# EAGLE design LifiEmitter (EAGLE 8.6.0)
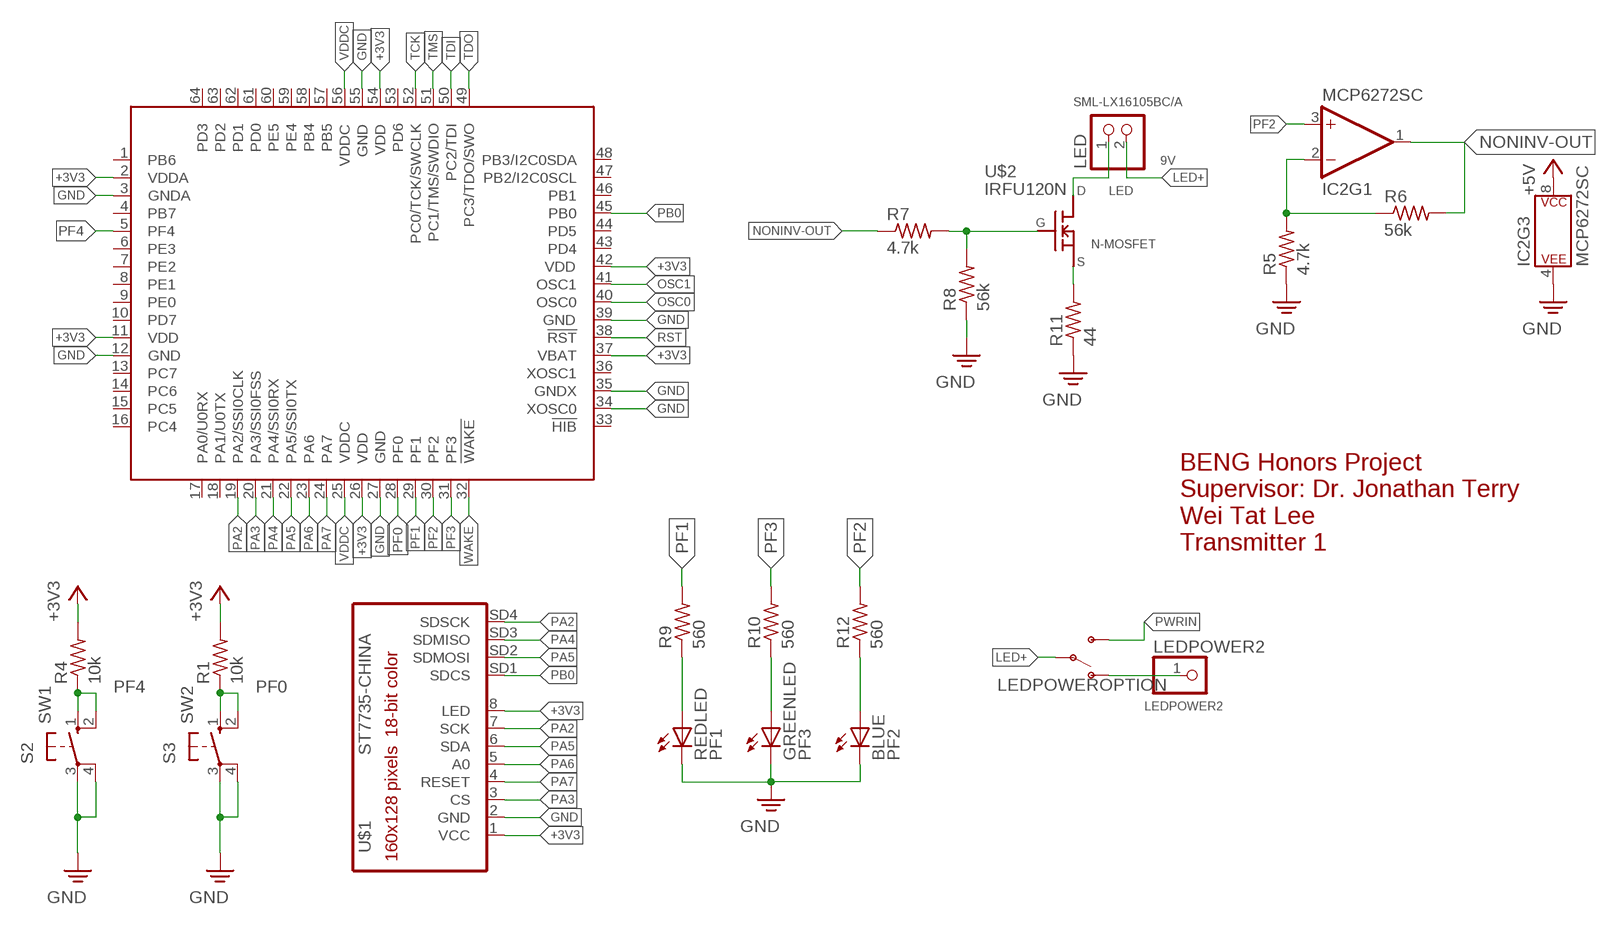
[diagram p0: schematic, sheet 1, part 1 of 2]
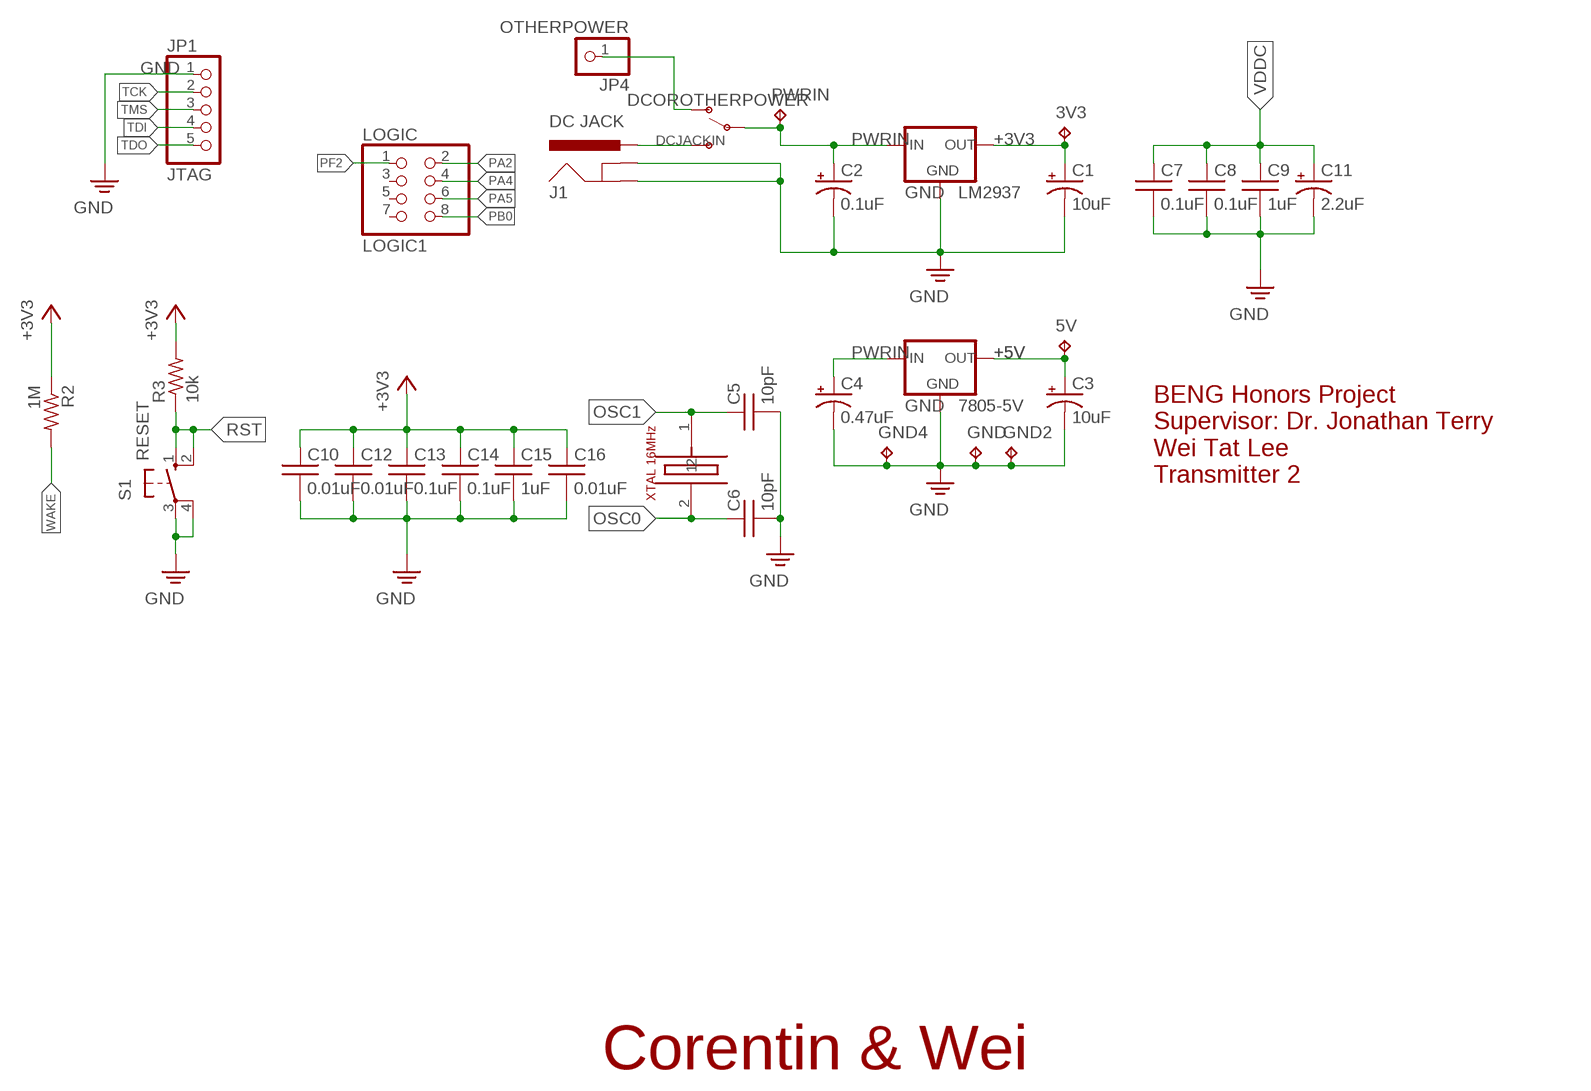
[diagram p1: schematic, sheet 1, part 2 of 2]

## Parts
3V3  TP_KEYSTONE500X  [P1.1MM]
5V  TP_KEYSTONE500X  [P1.1MM]
7805-5V  78XXS  [78XXS]
BLUE  PF2  LED5MM  [LED5MM]
C1  10uF  CAPACITOR_POLARIZEDE5-6  [CAP200MILPOLARIZED]
C2  0.1uF  CAPACITOR_POLARIZEDE5-6  [CAP200MILPOLARIZED]
C3  10uF  CAPACITOR_POLARIZEDE5-6  [CAP200MILPOLARIZED]
C4  0.47uF  CAPACITOR_POLARIZEDE5-6  [CAP200MILPOLARIZED]
C5  10pF  CAPACITOR025-024X044  [CAP100MIL]
C6  10pF  CAPACITOR025-024X044  [CAP100MIL]
C7  0.1uF  CAPACITOR025-024X044  [CAP100MIL]
C8  0.1uF  CAPACITOR025-024X044  [CAP100MIL]
C9  1uF  CAPACITOR025-024X044  [CAP100MIL]
C10  0.01uF  CAPACITOR025-024X044  [CAP100MIL]
C11  2.2uF  CAPACITOR_POLARIZEDE5-6  [CAP200MILPOLARIZED]
C12  0.01uF  CAPACITOR025-024X044  [CAP100MIL]
C13  0.1uF  CAPACITOR025-024X044  [CAP100MIL]
C14  0.1uF  CAPACITOR025-024X044  [CAP100MIL]
C15  1uF  CAPACITOR025-024X044  [CAP100MIL]
C16  0.01uF  CAPACITOR025-024X044  [CAP100MIL]
DCOROTHERPOWER  SWITCH-SPDT-PTH-11.6X4.0MM  [SWITCH_SPDT_PTH_11.6X4.0MM]
GND  TP_KEYSTONE500X  [P1.1MM]
GND2  TP_KEYSTONE500X  [P1.1MM]
GND4  TP_KEYSTONE500X  [P1.1MM]
GREENLED  PF3  LED5MM  [LED5MM]
IC1  TM4C123[1,3,B]XXPM  [PM_S-PQFP-G64]
IC2  MCP6272SC  [SOCKET-08]
J1  DC JACK  POWER_JACKPTH_BREAD  [POWER_JACK_PTH_BREAD]
JP1  JTAG  PINHD-1X5  [1X05]
JP4  OTHERPOWER  PINHD-1X1  [1X01]
LED  PINHD-1X2  [1X02]
LEDPOWER2  PINHD-1X1  [1X01]
LEDPOWEROPTION  SWITCH-SPDT-PTH-11.6X4.0MM  [SWITCH_SPDT_PTH_11.6X4.0MM]
LM2937  78XXS  [78XXS]
LOGIC  LOGIC1  PINHD-2X4  [2X04]
PWRIN  TP_KEYSTONE500X  [P1.1MM]
R1  10k  RESISTOR0309/10  [RES400MIL]
R2  1M  RESISTOR0309/10  [RES400MIL]
R3  10k  RESISTOR0309/10  [RES400MIL]
R4  10k  RESISTOR0309/10  [RES400MIL]
R5  4.7k  RESISTOR0309/10  [RES400MIL]
R6  56k  RESISTOR0309/10  [RES400MIL]
R7  4.7k  RESISTOR0309/10  [RES400MIL]
R8  56k  RESISTOR0309/10  [RES400MIL]
R9  560  RESISTOR0309/10  [RES400MIL]
R10  560  RESISTOR0309/10  [RES400MIL]
R11  44  RESISTOR0309/10  [RES400MIL]
R12  560  RESISTOR0309/10  [RES400MIL]
REDLED  PF1  LED5MM  [LED5MM]
S1  RESET  B3F-1052  [B3F-10XX]
S2  SW1  B3F-1052  [B3F-10XX]
S3  SW2  B3F-1052  [B3F-10XX]
U$1  ST7735-CHINA  [ST7735-CHINA]
U$2  IRFU120N  [TO251AA-V]
XTAL  16MHz  XTAL  [XTAL]

## Nets
+3V3: 3V3.TP C1.+ C10.1 C12.1 C13.1 C14.1 C15.1 C16.1 IC1.2(VDDA) IC1.11(VDD) IC1.26(VDD) IC1.37(VBAT) IC1.42(VDD) IC1.54(VDD) LM2937.OUT R1.2 R2.1 R3.2 R4.2 U$1.1(VCC) U$1.8(LED)
+5V: 5V.TP 7805-5V.OUT C3.+ IC2.8(P$V+)
DCJACKIN: DCOROTHERPOWER.3(S) J1.PWR
GND: 7805-5V.GND BLUE.K(C) C1.- C2.- C3.- C4.- C5.2 C6.2 C7.2 C8.2 C9.2 C10.2 C11.- C12.2 C13.2 C14.2 C15.2 C16.2 GND2.TP GND4.TP GND.TP GREENLED.K(C) IC1.3(GNDA) IC1.12(GND) IC1.27(GND) IC1.34(XOSC0) IC1.35(GNDX) IC1.39(GND) IC1.55(GND) IC2.4(P$V-) J1.GND J1.GNDBREAK JP1.1 LM2937.GND R5.1 R8.1 R11.1 REDLED.K(C) S1.3(P) S1.4(P1) S2.3(P) S2.4(P1) S3.3(P) S3.4(P1) U$1.2(GND)
LED+: LED.2 LEDPOWEROPTION.2(P)
LED-: LED.1 U$2.2(D)
LEDPOWER2: LEDPOWER2.1 LEDPOWEROPTION.1(O)
N$4: R9.1 REDLED.A
N$5: GREENLED.A R10.1
N$6: BLUE.A R12.1
NFET-G: R7.2 R8.2 U$2.1(G)
NFET-S: R11.2 U$2.3(S)
NONINV-OUT: IC2.1(OUT) R6.2 R7.1
NONINVIN-: IC2.2(-IN) R5.2 R6.1
OSC0: C6.1 IC1.40(OSC0) XTAL.2
OSC1: C5.1 IC1.41(OSC1) XTAL.1
OTHERPOWER: DCOROTHERPOWER.1(O) JP4.1
PA2: IC1.19(PA2/SSI0CLK) LOGIC.2 U$1.7(SCK) U$1.SD4(SDSCK)
PA3: IC1.20(PA3/SSI0FSS) U$1.3(CS)
PA4: IC1.21(PA4/SSI0RX) LOGIC.4 U$1.SD3(SDMISO)
PA5: IC1.22(PA5/SSI0TX) LOGIC.6 U$1.6(SDA) U$1.SD2(SDMOSI)
PA6: IC1.23(PA6) U$1.5(A0)
PA7: IC1.24(PA7) U$1.4(RESET)
PB0: IC1.45(PB0) LOGIC.8 U$1.SD1(SDCS)
PF0: IC1.28(PF0) R1.1 S3.1(S) S3.2(S1)
PF1: IC1.29(PF1) R9.2
PF2: IC1.30(PF2) IC2.3(+IN) LOGIC.1 R12.2
PF3: IC1.31(PF3) R10.2
PF4: IC1.5(PF4) R4.1 S2.1(S) S2.2(S1)
PWRIN: 7805-5V.IN C2.+ C4.+ DCOROTHERPOWER.2(P) LEDPOWEROPTION.3(S) LM2937.IN PWRIN.TP
RST: IC1.38(!RST) R3.1 S1.1(S) S1.2(S1)
TCK: IC1.52(PC0/TCK/SWCLK) JP1.2
TDI: IC1.50(PC2/TDI) JP1.4
TDO: IC1.49(PC3/TDO/SWO) JP1.5
TMS: IC1.51(PC1/TMS/SWDIO) JP1.3
VDDC: C7.1 C8.1 C9.1 C11.+ IC1.25(VDDC) IC1.56(VDDC)
WAKE: IC1.32(!WAKE) R2.2
Unconnected: IC1.1(PB6) IC1.4(PB7) IC1.6(PE3) IC1.7(PE2) IC1.8(PE1) IC1.9(PE0) IC1.10(PD7) IC1.13(PC7) IC1.14(PC6) IC1.15(PC5) IC1.16(PC4) IC1.17(PA0/U0RX) IC1.18(PA1/U0TX) IC1.33(!HIB) IC1.36(XOSC1) IC1.43(PD4) IC1.44(PD5) IC1.46(PB1) IC1.47(PB2/I2C0SCL) IC1.48(PB3/I2C0SDA) IC1.53(PD6) IC1.57(PB5) IC1.58(PB4) IC1.59(PE4) IC1.60(PE5) IC1.61(PD0) IC1.62(PD1) IC1.63(PD2) IC1.64(PD3) IC2.5(+IN) IC2.6(-IN) IC2.7(OUT) LOGIC.3 LOGIC.5 LOGIC.7

## Notes on the sheet
- SML-LX16105BC/A
- 9V
- D | LED
- G
- N-MOSFET
- S
- BENG Honors Project
  Supervisor: Dr. Jonathan Terry
  Wei Tat Lee
  Transmitter 2
- BENG Honors Project
  Supervisor: Dr. Jonathan Terry
  Wei Tat Lee
  Transmitter 1
- LEDPOWER2
- Corentin & Wei

## Library data of the parts
3V3 5V GND GND2 GND4 PWRIN = EE445L:TP: Test pad Test point, black, Keystone Electronics 5001, Digikey 5001K-ND Test point, orange, Keystone Electronics 5003, Digikey 5003K-ND Test point, yellow, Keystone Electronics 5004, Digikey 5004K-ND Test point, white, Keystone Electronics 5002, Digikey 5002K-ND Test point, red, Keystone Electronics 5000, Digikey 5000K-ND
7805-5V LM2937 = EE445L:78XXS: VOLTAGE REGULATOR 7805, 78M05, LM2937-5.0, LM2937-3.3
BLUE GREENLED REDLED = EE445L:LED: Avago Technologies LED Green 2mA 5mm diffused, HLMP-4740, Digikey 516-1327-ND Red 1.6V 1mA 5mm diffused, HLMP-D150, Digikey 516-1323-ND Yellow 2mA 5mm diffused, HLMP-4719, Digikey 516-1326-ND Orange 10mA 5mm diffused HLMP-D401, Digikey 516-1330-ND Blue 10mA 5mm diffused
C1-C4 C11 = EE445L:CAPACITOR_POLARIZED: POLARIZED CAPACITOR, American symbol
C5-C10 C12-C16 = EE445L:CAPACITOR: CAPACITOR, American symbol
DCOROTHERPOWER LEDPOWEROPTION = SparkFun-Switches:SWITCH-SPDT: Single Pole, Double Throw (SPDT) Switch Single-pole, double-throw (SPDT) switch. Variant Overview SMD-AYZ0202 Surface Mount DPDT Switch <https://www.sparkfun.com/products/597> (COM-00597) Used on e.g. LilyPad Arduino USB - ATmega32U4 Board <https://www.sparkfun.com/products/12049> PTH-11.6X4.0MM SPDT Mini Power Switch <https://www.sparkfun.com/products/102> (COM-00102) Used on e.g. SparkFun Simon Says - Through-Hole Soldering Kit <https://www.sparkfun.com/products/10547> (KIT-10547) PTH-11.6X4.0MM-KIT KIT version of SPDT Mini Power Switch - Simplifies soldering by removing tStop of switch pins - only one side can be soldered. PTH-11.6X4.0MM-LOCK LOCK version of SPDT Mini Power Switch - Offset pins hold switch in place for easier soldering. SMD-RIGHT-ANGLE Surface Mount Right Angle Switch <https://www.sparkfun.com/products/10860> (COM-10860) Used on e.g. SparkFun ESP8266 Thing <https://www.sparkfun.com/products/13231>; PROD_ID: SWCH-08261; SF_SKU: COM-00102
IC1 = ti-tiva:TM4C123[1,3,B]XX: by RobG (430things/43oh/Tindie)
IC2 = my-library:MCP6272: Generic op-amp footprint This component is for the standard 358 pinning of a dual op-amp From the LM358 datasheet: Pin 1: Output A Pin 2: Inverting Input A Pin 3: Non-Inverting Input A Pin 4: Gnd Pin 5: Non-Inverting Input B Pin 6: Inverting Input B Pin 7: Output B Pin 8: V+
J1 = SparkFun-Connectors:POWER_JACK: Power Jack Connector This is the standard 5.5mm barrel jack for power. The PTH is the most common, proven, reliable, footprint. The Slot footprint only works if the mill layer is transmitted to the PCB fab house so be warned. Here are the connectors we sell at SparkFun: DC Barrel Power Jack/Connector <https://www.sparkfun.com/products/119> (PRT-00119) DC Barrel Power Jack/Connector (SMD) <https://www.sparkfun.com/products/12748> (PRT-12748) DC Barrel Jack Adapter - Breadboard Compatible <https://www.sparkfun.com/products/10811> (PRT-10811) It is used on this SparkFun product (and many, many others): SparkFun RedBoard - Programmed with Arduino <https://www.sparkfun.com/products/12757> (DEV-12757) Also, if you need a mating power supply or connector, please check these out: Wall Adapter Power Supply - 9VDC 650mA <https://www.sparkfun.com/products/298> (TOL-00298) DC Barrel Jack Adapter - Male <https://www.sparkfun.com/products/10287> (PRT-10287); PROD_ID: PRT-10811
JP1 = pinhead:PINHD-1X5: PIN HEADER
JP4 LEDPOWER2 = EE445L:PINHD-1X1: PIN HEADER
LED = EE445L:PINHD-1X2: PIN HEADER
LOGIC = EE445L:PINHD-2X4: PIN HEADER
R1-R12 = EE445L:RESISTOR: RESISTOR, American symbol
S1-S3 = EE445L:B3F-1052: OMRON SWITCH 1.1mm holes; MPN: B3F-1000; OC_FARNELL: 176432; OC_NEWARK: 36M3542
U$1 = my-library:ST7735-CHINA
U$2 = my-library:IRFU120N
XTAL = LEE:XTAL: NX5032GAcrystal XTAL

## Board
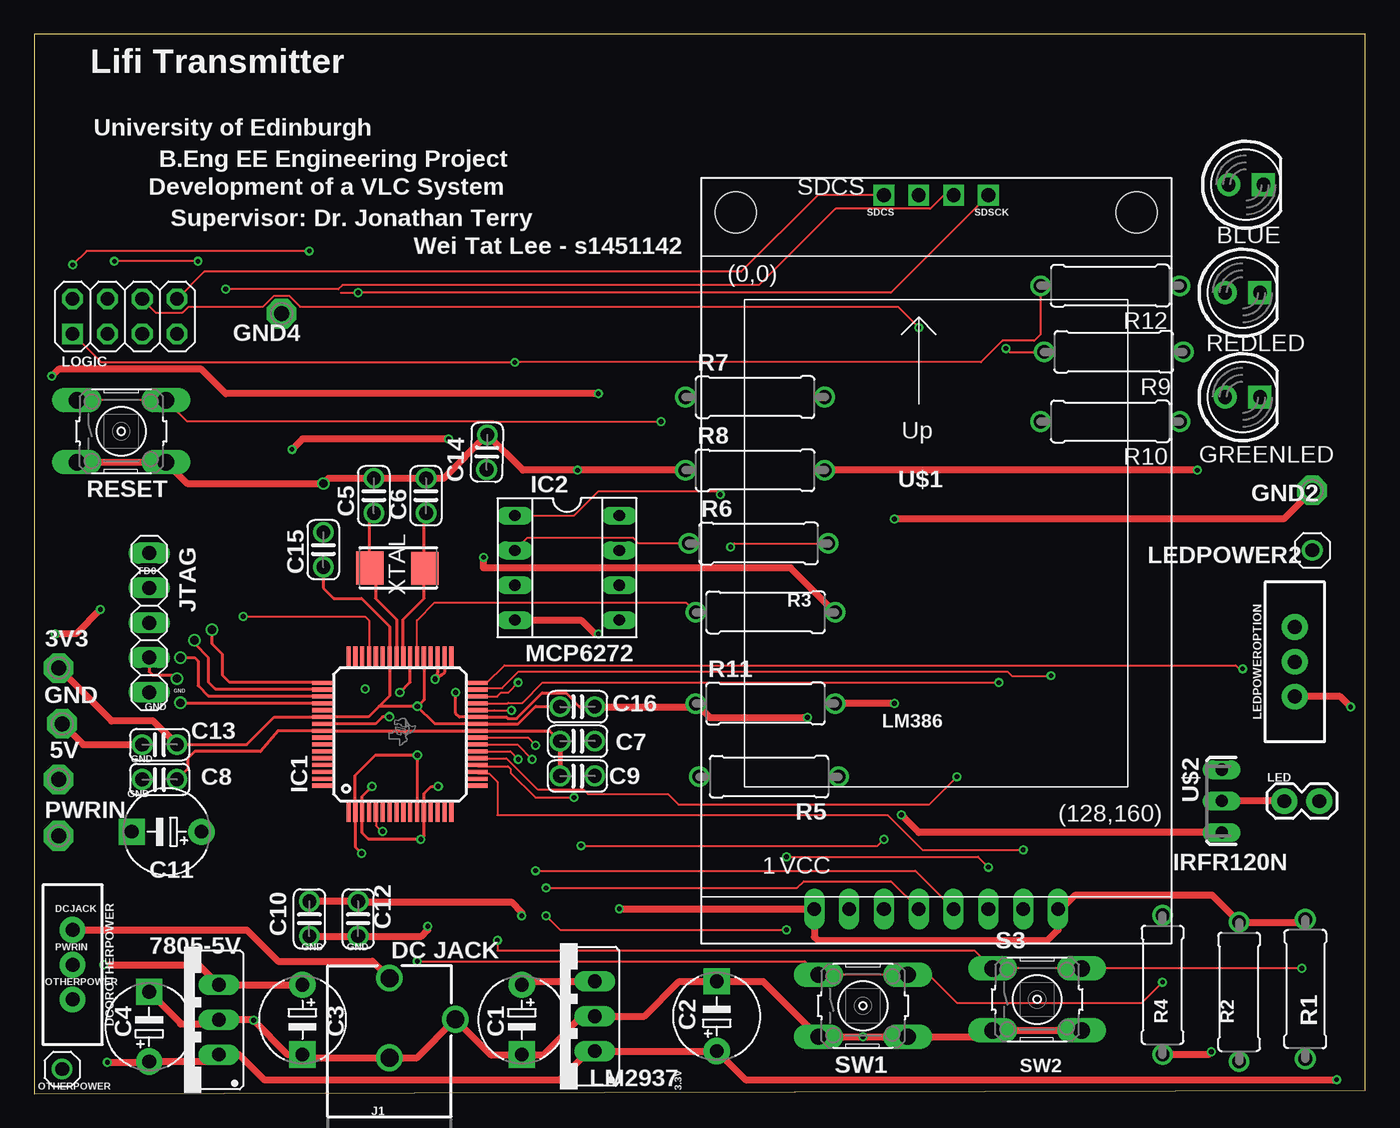
[diagram p2: board, top side]
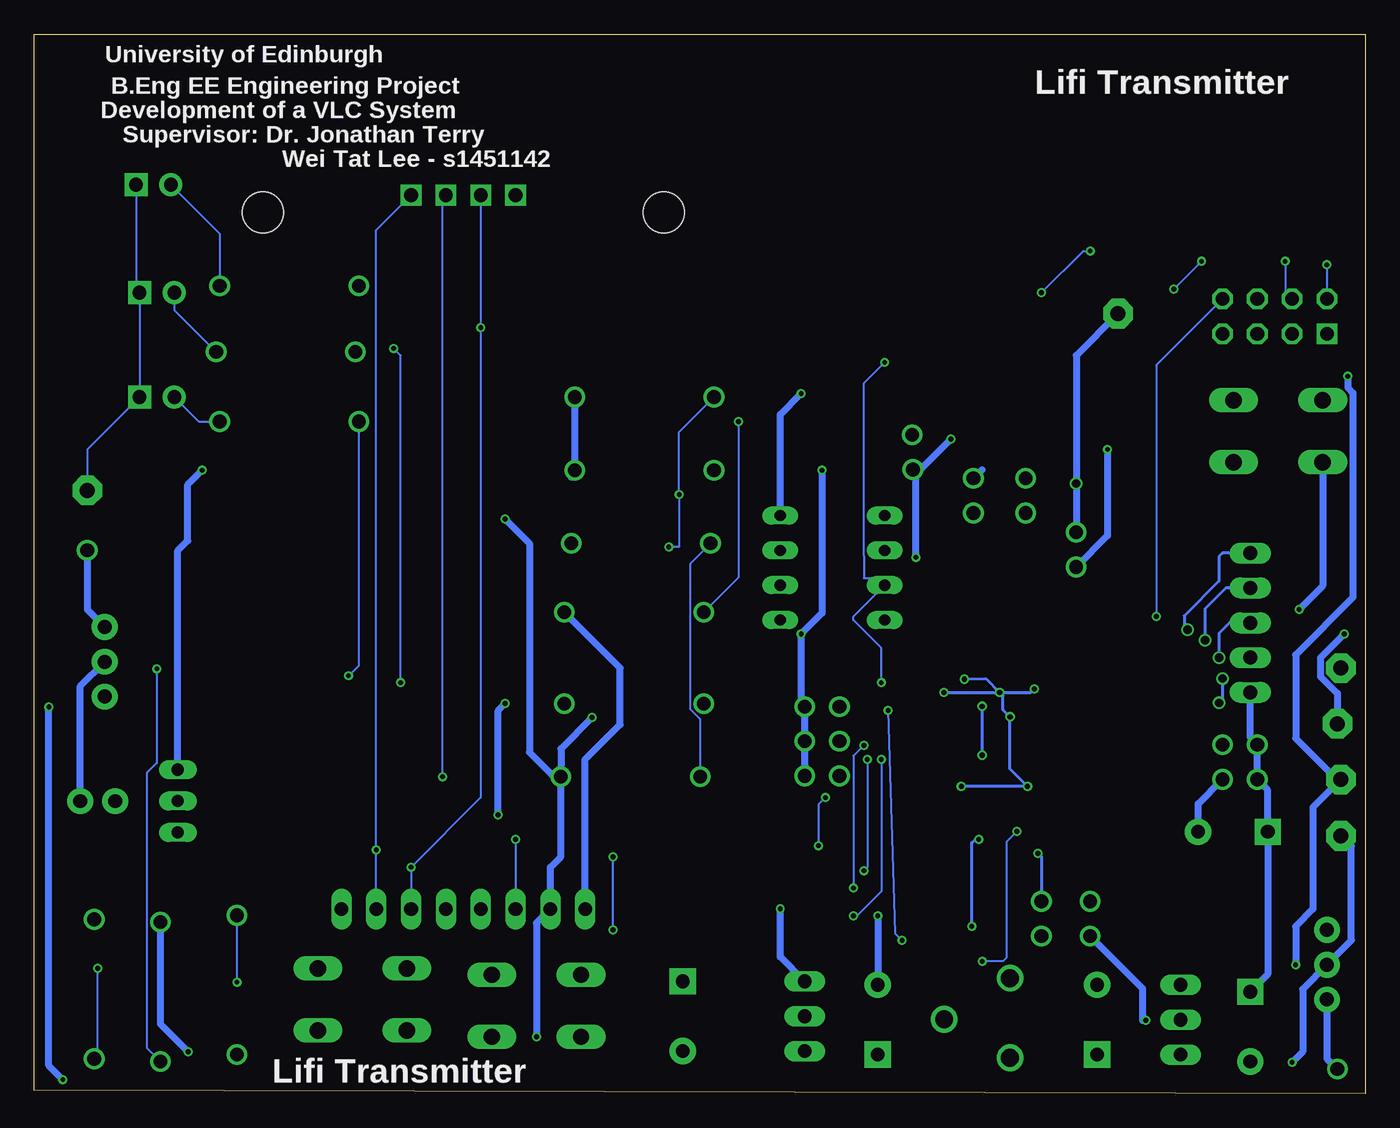
[diagram p3: board, bottom side, seen from below]

Size 97.08 x 77.27 mm. Coordinates in mm from the lower left corner, seen from the top.
Outline: 0,0 97.08,0.25 97.08,77.27 0,77.27 0,0
Copper layers (1*16): Top 0.035mm / dielectric 1.5mm / Bottom 0.035mm
Design rules "SeeedStudio_2layer_DRU_no_angle_20140221": minimum track width 6mil, minimum drill 12mil, track to track 6mil, track to pad 6mil, pad to pad 6mil, via to via 6mil, smd to smd 0mil, copper to edge 10mil, drill to drill 10mil, minimum pad ring 10mil, minimum via ring 6mil, stop-mask expansion 2mil, vias tented up to drill 100mil, thermal gap 10mil

### Footprints (pad centres in the part's own frame; a part is rotated, then mirrored left to right if it is on the bottom)
P1.1MM = drill 1.1 pad 2.159 octagon: TP 0,0
78XXS = drill 1 long: GND 0,-2.54; IN -2.54,-2.54; OUT 2.54,-2.54
LED5MM = drill 1 pad 1.676: A -1.27,0 | drill 1 pad 1.676 square: K 1.27,0
CAP200MILPOLARIZED = drill 1 pad 1.905: + -2.54,0 | drill 1 pad 1.905 square: - 2.54,0
CAP100MIL = drill 1: 1 -1.27,0; 2 1.27,0
SWITCH_SPDT_PTH_11.6X4.0MM = drill 1.016 pad 1.88: 1 0,2.54; 2 0,0; 3 0,-2.54
PM_S-PQFP-G64 = smd 1.6 x 0.3: 1 -5.6,3.75; 2 -5.6,3.25; 3 -5.6,2.75; 4 -5.6,2.25; 5 -5.6,1.75; 6 -5.6,1.25; 7 -5.6,0.75; 8 -5.6,0.25; 9 -5.6,-0.25; 10 -5.6,-0.75; 11 -5.6,-1.25; 12 -5.6,-1.75; 13 -5.6,-2.25; 14 -5.6,-2.75; 15 -5.6,-3.25; 16 -5.6,-3.75; 33 5.6,-3.75; 34 5.6,-3.25; 35 5.6,-2.75; 36 5.6,-2.25; 37 5.6,-1.75; 38 5.6,-1.25; 39 5.6,-0.75; 40 5.6,-0.25; 41 5.6,0.25; 42 5.6,0.75; 43 5.6,1.25; 44 5.6,1.75; 45 5.6,2.25; 46 5.6,2.75; 47 5.6,3.25; 48 5.6,3.75 | smd 0.3 x 1.6: 17 -3.75,-5.6; 18 -3.25,-5.6; 19 -2.75,-5.6; 20 -2.25,-5.6; 21 -1.75,-5.6; 22 -1.25,-5.6; 23 -0.75,-5.6; 24 -0.25,-5.6; 25 0.25,-5.6; 26 0.75,-5.6; 27 1.25,-5.6; 28 1.75,-5.6; 29 2.25,-5.6; 30 2.75,-5.6; 31 3.25,-5.6; 32 3.75,-5.6; 49 3.75,5.6; 50 3.25,5.6; 51 2.75,5.6; 52 2.25,5.6; 53 1.75,5.6; 54 1.25,5.6; 55 0.75,5.6; 56 0.25,5.6; 57 -0.25,5.6; 58 -0.75,5.6; 59 -1.25,5.6; 60 -1.75,5.6; 61 -2.25,5.6; 62 -2.75,5.6; 63 -3.25,5.6; 64 -3.75,5.6
SOCKET-08 = drill 0.813 long: 1 -3.81,-3.81; 2 -1.27,-3.81; 3 1.27,-3.81; 4 3.81,-3.81; 5 3.81,3.81; 6 1.27,3.81; 7 -1.27,3.81; 8 -3.81,3.81
POWER_JACK_PTH_BREAD = drill 1.3: GND 0,7.9; GNDBREAK 4.8,10.7; PWR 0,13.7
1X05 = drill 1.016 long: 1 -5.08,0; 2 -2.54,0; 3 0,0; 4 2.54,0; 5 5.08,0
1X01 = drill 1: 1 0,0
1X02 = drill 1 pad 1.88: 1 0,0; 2 2.54,0
2X04 = drill 1 square: 1 -3.81,-1.27 | drill 1 octagon: 2 -3.81,1.27; 3 -1.27,-1.27; 4 -1.27,1.27; 5 1.27,-1.27; 6 1.27,1.27; 7 3.81,-1.27; 8 3.81,1.27
RES400MIL = drill 1: 1 -5.08,0; 2 5.08,0
B3F-10XX = drill 1.2 long: 1 -3.251,2.261; 2 3.251,2.261; 3 -3.251,-2.261; 4 3.251,-2.261
ST7735-CHINA = drill 1 long: 1 -7.62,-30.48; 2 -5.08,-30.48; 3 -2.54,-30.48; 4 0,-30.48; 5 2.54,-30.48; 6 5.08,-30.48; 7 7.62,-30.48; 8 10.16,-30.48 | drill 1 square: SD1 -2.54,21.59; SD2 0,21.59; SD3 2.54,21.59; SD4 5.08,21.59 | hole 3: -13.335,20.32; 15.875,20.32
TO251AA-V = drill 0.889 long: 1 -2.286,0; 2 0,0; 3 2.286,0
XTAL = smd 2 x 2.4: 1 -6.007,0.046; 2 -1.982,0.034

### Placement (x,y rotation side)
3V3  1.78,31.04 0 top
5V  1.78,22.91 180 top
7805-5V  10.92,5.38 90 top
BLUE  88.39,66.29 0 top
C1  35.56,5.38 270 top
C2  49.78,5.64 90 top
C3  19.56,5.38 270 top
C4  8.38,4.88 90 top
C5  24.77,43.61 90 top
C6  28.57,43.61 90 top
C7  39.62,25.7 0 top
C8  9.14,22.91 180 top
C9  39.62,23.16 0 top
C10  20.07,12.75 270 top
C11  9.65,19.1 180 top
C12  23.62,12.75 270 top
C13  9.14,25.45 180 top
C14  33.02,46.79 88.8 top
C15  21.08,39.67 90 top
C16  39.62,28.22 0 top
DCOROTHERPOWER  2.79,9.4 180 top
GND  2.03,26.97 0 top
GND2  93.22,43.99 0 top
GND4  18.03,56.9 0 top
GREENLED  88.14,50.8 0 top
IC1  26.67,26.21 90 top
IC2  38.86,38.35 270 top
J1  25.91,-5.28 0 top
JP1  8.38,34.34 90 top
JP4  2.03,1.78 0 top
LED  91.19,21.34 0 top
LEDPOWER2  93.22,39.62 0 top
LEDPOWEROPTION  91.95,31.5 0 top
LM2937  38.35,5.64 90 top
LOGIC  6.6,56.69 0 top
PWRIN  1.78,18.8 0 top
R1  92.71,7.62 90 top
R2  87.88,7.42 270 top
R3  53.34,35.1 0 top
R4  82.3,7.92 270 top
R5  53.59,23.11 180 top
R6  52.83,40.13 0 top
R7  52.58,50.8 0 top
R8  52.58,45.47 0 top
R9  78.74,54.1 180 top
R10  78.49,49.02 180 top
R11  53.34,28.45 0 top
R12  78.49,58.93 180 top
REDLED  88.14,58.42 0 top
S1  6.35,48.31 0 top
S2  60.45,6.4 0 top
S3  73.15,6.86 0 top
U$1  64.52,43.94 0 top
U$2  86.61,21.34 270 top
XTAL  30.48,38.28 0 top

### Tracks (layer width: path | path; a pad name or v marks a point on that pad's centre or on a via)
+3V3  (via drill 0.35, 0.38 pad 0.18)
  Top 0.203: C15.1 21.08,36.88 21.84,36.12 23.88,36.12 25.91,34.09 25.91,31.82 IC1.42 25.92,29.02 25.15,28.24 | 25.15,28.24 24.38,27.48 21.09,27.48 IC1.54 17.51,27.46 15.49,25.45 C13.1 | IC1.11 27.94,20.63 v27.94,24.69 24.89,24.69 23.42,23.22 IC1.2 23.42,17.98 v23.88,17.53 | v27.94,28.24 25.15,28.24 | v27.94,28.24 29.22,26.96 IC1.26 35.29,26.96 36.58,28.24 38.33,28.24 C16.1 | IC1.37 28.42,28.72 v27.94,28.24 | C12.1 23.67,13.97 | 35.56,13.21 v35.56,12.95
  Top 0.508: C13.1 8.69,27.18 5.64,27.18 3V3.TP | C12.1 C10.1 | 23.67,13.97 34.8,13.97 35.56,13.21 | C1.+ 35.81,8.18 LM2937.OUT | v42.67,13.46 U$1.1 56.9,11.43 57.15,11.18 73.91,11.18 74.68,11.94 U$1.8 74.93,13.46 75.95,14.48 85.9,14.48 R2.1 92.51,12.5 R1.2 | R3.2 55.17,38.35 32.77,38.35 v32.77,39.12 | v30.23,47.75 19.56,47.75 v18.8,46.99 | v85.85,3.05 85.65,2.84 R4.2
  Bottom 0.203: v27.94,24.69 v27.94,28.24 | v23.88,17.53 23.62,17.27 C12.1
  Bottom 0.508: v35.56,12.95 C1.+ | LM2937.OUT 42.67,9.96 v42.67,13.46 | U$1.1 56.9,24.38 54.36,26.92 54.36,31.04 R3.2 | v32.77,39.12 32.77,45.29 C14.1 32.46,45.52 v30.23,47.75 | v18.8,46.99 18.8,40.69 C15.1 | R2.1 87.88,5.08 v85.85,3.05
+5V  (via drill 0.35)
  Top 0.508: v5.08,9.4 11.99,9.4 7805-5V.OUT C3.+ | v41.15,51.05 13.97,51.05 12.19,52.83 1.78,52.83 v1.27,52.32
  Bottom 0.508: 5V.TP 1.93,22.76 | 1.93,22.76 3.81,20.88 3.81,13.46 5.08,12.19 v5.08,9.4 | IC2.8 42.67,49.53 v41.15,51.05 | v1.27,52.32 1.27,51.49 0.89,51.11 0.89,36.19 5.08,32 5.08,25.91 1.93,22.76
DCJACKIN
  Top 0.508: DCOROTHERPOWER.3 15.49,11.94 17.78,9.65 24.67,9.65 J1.PWR 26.16,8.16 26.16,7.87
GND  (via drill 0.35, 0.38 pad 0.18, 0.6)
  Top 0.203: v24.64,22.4 23.92,21.68 IC1.3 23.92,19.01 24.38,18.54 v28.19,18.54 28.45,18.8 28.45,20.07 28.42,20.09 IC1.12 28.45,20.64 28.45,21.89 28.96,22.4 v29.46,22.4 | v25.91,27.48 25.4,27.48 24.89,26.97 21.08,26.97 IC1.55 | v26.67,29.26 27.43,30.02 27.43,31.8 IC1.39 | v30.73,29.26 30.73,27.74 31.01,27.46 IC1.27 34.45,27.46 34.56,27.36 35.19,27.36 37.06,29.23 38.77,29.23 39.78,28.22 C16.2 | IC1.35 29.42,30.74 v29.23,30.22 29.72,30.53 29.92,30.73 IC1.34
  Top 0.508: C4.- 10.67,5.13 10.67,5.08 13.16,5.08 7805-5V.GND 15.95,5.38 v16,5.33 18.49,2.84 C3.- 19.79,2.62 J1.GND 27.91,2.62 J1.GNDBREAK 33.28,2.84 C1.- 37.13,2.84 39.93,5.64 LM2937.GND 44.5,5.64 47.04,8.18 C2.- 53.16,8.18 S2.3 v60.45,4.14 S2.4 69.44,4.14 S3.3 S3.4 | GND.TP 3.56,25.45 C13.2 | C10.2 C12.2 28.24,11.48 28.7,11.94 v28.7,12.19 | S1.3 S1.4 11.15,44.5 v21.08,44.5 21.46,44.88 C5.2 C6.2 29.87,44.88 C14.2 35.64,45.47 v39.62,45.47 R8.1 | IC2.4 39.88,34.54 40.89,33.53 v41.15,33.53 | C16.2 48.03,28.22 R11.1 49.28,27.43 v56.39,27.43 | GND2.TP 91.14,41.91 v62.74,41.91 | v4.83,35.31 3.05,33.53 v1.52,33.53
  Bottom 0.152: BLUE.K 89.66,58.67 REDLED.K GREENLED.K 93.22,46.99 GND2.TP
  Bottom 0.203: v29.46,22.4 v24.64,22.4 25.91,23.67 v25.91,27.48 26.42,27.99 26.42,29.01 v26.67,29.26 | v30.73,29.26 v26.67,29.26 | v29.23,30.22 27.69,30.28 v26.67,29.26 | v26.67,29.26 24.38,29.26 v24.13,29.51 | v28.7,12.19 28.7,18.29 28.45,18.54 v28.19,18.54
  Bottom 0.508: C9.2 C7.2 C16.2 41.15,28.47 v41.15,33.53 39.62,35.05 v39.62,45.47 | C15.2 v21.08,44.5 21.08,53.85 GND4.TP | v60.45,4.14 60.45,12.45 U$1.2 59.44,16.51 58.67,17.27 R5.1 | C4.- 7.11,8.69 C11.- 7.11,22.15 C8.2 C13.2 8.38,25.96 JP1.1 | C10.2 16.26,7.67 16.26,5.33 v16,5.33 | 27.94,45.52 C6.2 | v56.39,27.43 58.67,25.15 R5.1 | v62.74,41.91 60.96,40.13 60.96,24.89 59.18,23.11 R5.1 | S1.3 3.1,37.03 v4.83,35.31 | GND.TP 2.03,29.19 3.26,30.42 3.26,31.79 v1.52,33.53
LED+
  Bottom 0.508: LED.2 93.73,29.72 LEDPOWEROPTION.2
LED-
  Top 0.508: LED.1 U$2.2
LEDPOWER2
  Bottom 0.508: LEDPOWER2.1 93.22,35.31 LEDPOWEROPTION.1
N$4
  Bottom 0.152: REDLED.A 86.87,57.15 R9.1
N$5
  Bottom 0.152: GREENLED.A 85.09,49.02 R10.1
N$6
  Bottom 0.152: BLUE.A 83.57,62.74 R12.1
NFET-G  (via drill 0.35)
  Top 0.508: v84.84,45.47 R8.2
  Bottom 0.508: U$2.1 86.61,39.61 85.89,40.33 85.89,44.41 v84.84,45.47 | R7.2 R8.2 | R8.2 57.66,45.21 57.91,44.96 57.91,45.21 R8.2
NFET-S  (via drill 0.35)
  Top 0.508: U$2.3 64.52,19.05 v63.25,20.32 | v62.74,28.45 R11.2
  Bottom 0.508: v63.25,20.32 63.25,27.94 v62.74,28.45
NONINV-OUT  (via drill 0.35)
  Top 0.152: v50.8,39.88 51.05,40.13 R6.2 | IC2.1 39.37,42.16 41.15,43.94 49.78,43.94 v50.04,43.69
  Bottom 0.152: v50.8,39.88 50.04,39.88 v50.04,43.69 50.04,48.26 R7.1
NONINVIN-
  Top 0.152: R6.1 44.08,40.13 43.7,40.51 35.94,40.51 IC2.2
  Bottom 0.152: R5.2 48.51,27.31 49.24,28.04 49.24,38.64 R6.1
OSC0
  Top 0.203: IC1.40 26.92,34.59 28.45,36.12 28.45,38.26 XTAL.2 28.5,38.35 28.45,38.4 28.45,42.21 C6.1
OSC1
  Top 0.203: XTAL.1 24.89,38.32 24.89,38.15 | 24.89,38.15 24.89,36.12 26.42,34.59 IC1.41 | XTAL.1 24.72,38.32 24.89,38.15 | XTAL.1 24.47,42.05 C5.1
OTHERPOWER
  Bottom 0.508: DCOROTHERPOWER.1 2.79,2.54 JP4.1
PA2  (via drill 0.35)
  Top 0.152: IC1.19 32.39,23.34 33.16,23.34 33.78,22.72 33.78,20.32 62.23,20.32 64.77,17.78 v72.14,17.78 72.39,17.78 | U$1.SD4 62.48,58.42 v23.62,58.42 22.35,58.42 | v20.07,61.47 3.81,61.47 v2.79,60.45
  Bottom 0.152: U$1.7 v72.14,17.78 72.14,62.99 U$1.SD4 | v23.62,58.42 20.57,61.47 v20.07,61.47 | v2.79,60.45 LOGIC.2
PA3  (via drill 0.35)
  Top 0.152: IC1.20 32.36,23.88 34.54,23.88 34.75,23.67 34.75,23.39 36.55,21.59 v39.37,21.59 | v39.88,18.08 61.52,18.08 v61.98,18.54
  Bottom 0.152: v39.37,21.59 39.88,21.08 v39.88,18.08 39.88,18.03 | v61.98,18.54 U$1.3
PA4  (via drill 0.35)
  Top 0.152: IC1.21 34.44,24.46 36.72,22.18 40.05,22.18 40.39,21.84 46.23,21.84 46.99,21.08 65.28,21.08 v67.31,23.11 | U$1.SD3 66.35,65.53 65.36,64.55 58.45,64.55 52.88,58.98 22.48,58.98 22.18,58.67 v13.97,58.67 13.72,58.67 | v11.94,60.71 v5.84,60.71
  Bottom 0.152: v67.31,23.11 67.31,65.28 U$1.SD3 | v13.97,58.67 12.19,60.45 12.19,60.71 v11.94,60.71 | v5.84,60.71 5.84,58.47 LOGIC.4
PA5  (via drill 0.35)
  Top 0.152: IC1.22 34.73,24.96 v35.31,24.38 | v37.34,12.95 38.35,11.94 v54.86,11.94 | v69.6,16.51 68.83,17.27 v54.86,17.27 | LOGIC.6 8.86,56.98 10.82,56.98 11.25,57.4 16.69,57.4 17.49,58.2 18.58,58.2 19.38,57.4 62.99,57.4 v64.52,55.88
  Bottom 0.152: v35.31,24.38 35.31,14.73 37.08,12.95 v37.34,12.95 | v54.86,11.94 v54.86,17.27 | U$1.6 v69.6,16.51 64.52,21.59 v64.52,55.88 U$1.SD2
PA6  (via drill 0.35)
  Top 0.152: IC1.23 35.24,25.46 v36.32,24.38 | v36.58,16.26 64.26,16.26 U$1.5
  Bottom 0.152: v36.32,24.38 36.32,16.51 v36.58,16.26
PA7  (via drill 0.35)
  Top 0.152: IC1.24 36.01,25.96 v36.58,25.4 | v37.34,14.99 55.63,14.99 56.13,15.49 62.48,15.49 U$1.4
  Bottom 0.152: v36.58,25.4 37.34,24.64 v37.34,14.99
PB0  (via drill 0.35)
  Top 0.152: U$1.SD1 57.15,65.53 51.56,59.94 12.4,59.94 LOGIC.8 | v15.24,34.8 24.13,34.8 24.42,34.51 IC1.45
  Bottom 0.152: LOGIC.8 15.24,53.14 v15.24,34.8
PF0  (via drill 0.35)
  Top 0.152: IC1.28 33.55,27.96 v34.8,27.94 | v33.78,11.18 33.78,10.41 68.61,10.41 S3.1 S3.2 76.43,9.14 v92.46,9.14
  Bottom 0.152: v34.8,27.94 34.29,11.68 v33.78,11.18 | R1.1 92.46,2.79 v92.46,9.14
PF1  (via drill 0.35)
  Top 0.152: IC1.29 34.53,28.46 34.57,28.5 35.61,28.5 37.08,29.97 v70.36,29.97 | v70.87,54.36 71.12,54.1 R9.2
  Bottom 0.152: v70.36,29.97 70.36,53.85 v70.87,54.36
PF2  (via drill 0.35)
  Top 0.152: IC1.30 33.76,28.96 34.06,29.26 34.59,29.26 v35.31,29.97 | LOGIC.1 4.88,53.34 v35.05,53.34 69.06,53.34 70.64,54.91 72.95,54.91 73.41,55.37 R12.2
  Bottom 0.152: v35.31,29.97 35.31,32.51 37.34,34.54 37.34,34.8 35.31,36.83 | 35.31,36.83 IC2.3 | v35.05,53.34 36.6,51.79 36.6,39.26 36.58,39.23 36.58,37.59 36.07,37.59 35.31,36.83
PF3  (via drill 0.35)
  Top 0.152: IC1.31 32.39,29.58 34.13,29.58 35.33,30.79 70.99,30.79 71.3,30.48 v74.17,30.48
  Bottom 0.152: v74.17,30.48 73.41,31.24 R10.2
PF4  (via drill 0.35)
  Top 0.152: IC1.5 24.92,19.53 25.15,19.3 25.22,19.3 v25.4,19.12 | v27.94,9.65 56.21,9.65 S2.1 S2.2 65.25,8.66 67.31,6.6 80.77,6.6 v82.3,8.13
  Bottom 0.152: v25.4,19.12 26.16,18.36 26.16,9.91 26.42,9.65 v27.94,9.65 | v82.3,8.13 R4.1
PWRIN  (via drill 0.35)
  Top 0.508: v5.33,2.29 8.33,2.29 C4.+ 12.95,2.34 7805-5V.IN 14.94,2.84 16.76,1.02 38.35,1.02 40.44,3.1 LM2937.IN C2.+ 51.87,1.02 v95,1.02 | v96.01,28.19 95.25,28.96 LEDPOWEROPTION.3
  Bottom 0.508: v5.33,2.29 4.57,3.05 4.57,7.62 DCOROTHERPOWER.2 1.02,11.18 1.02,18.03 PWRIN.TP | v95,1.02 96.01,2.03 v96.01,28.19
RST  (via drill 0.35)
  Top 0.152: S1.1 S1.2 11.12,49.05 33.46,49.05 33.48,49.02 v45.72,49.02 | IC1.38 27.92,34.52 29.21,35.81 47.55,35.81 R3.1
  Bottom 0.152: v45.72,49.02 45.72,37.64 R3.1
TCK  (via drill 0.6)
  Top 0.203: JP1.2 8.38,30.78 8.64,30.53 10.16,30.53 v10.41,30.28 | v10.67,28.5 21.03,28.5 IC1.52
  Bottom 0.203: v10.41,30.28 10.41,28.75 v10.67,28.5
TDI  (via drill 0.6)
  Top 0.203: v11.68,33.07 11.68,32.82 12.7,31.8 12.7,30.02 13.21,29.51 21.02,29.51 IC1.50
  Bottom 0.203: JP1.4 10.16,36.88 11.68,35.36 v11.68,33.07
TDO  (via drill 0.6)
  Top 0.203: v12.95,33.83 12.95,32.82 13.72,32.05 13.72,30.53 14.22,30.02 21.01,30.02 IC1.49
  Bottom 0.203: JP1.5 10.41,39.42 10.67,39.17 10.67,37.39 13.21,34.85 13.21,34.09 v12.95,33.83
TMS  (via drill 0.6)
  Top 0.203: v10.67,31.8 11.68,31.8 11.94,31.55 11.94,29.77 12.7,29.01 21.03,29.01 IC1.51
  Bottom 0.203: JP1.3 9.91,34.34 10.67,33.58 v10.67,31.8
VDDC
  Top 0.203: C7.1 37.6,26.46 IC1.25 IC1.56 17.78,26.46 16.51,24.94 11.68,24.94 11.18,24.43 11.18,23.67 C8.1
  Top 0.381: C7.1 C9.1
  Bottom 0.508: C11.+ 12.19,21.13 C8.1
WAKE  (via drill 0.35)
  Top 0.152: IC1.32 33.01,29.96 34.29,31.24 87.63,31.24 87.88,30.99 v88.14,30.99
  Bottom 0.152: v88.14,30.99 88.14,24.11 88.87,23.38 88.87,3.32 R2.2

### Text on the board
tNames: Lifi Transmitter | University of Edinburgh | B.Eng EE Engineering Project | Development of a VLC System | Supervisor: Dr. Jonathan Terry | SDCS | SDSCK | Wei Tat Lee - s1451142 | TD0 | MCP6272 | GND | GND | LM386 | GND | GND | IRFR120N | DCJACK | PWRIN | GND | GND | OTHERPOWER | SW2 | 3.3V | OTHERPOWER
bNames: University of Edinburgh | B.Eng EE Engineering Project | Lifi Transmitter | Development of a VLC System | Supervisor: Dr. Jonathan Terry | Wei Tat Lee - s1451142 | Lifi Transmitter